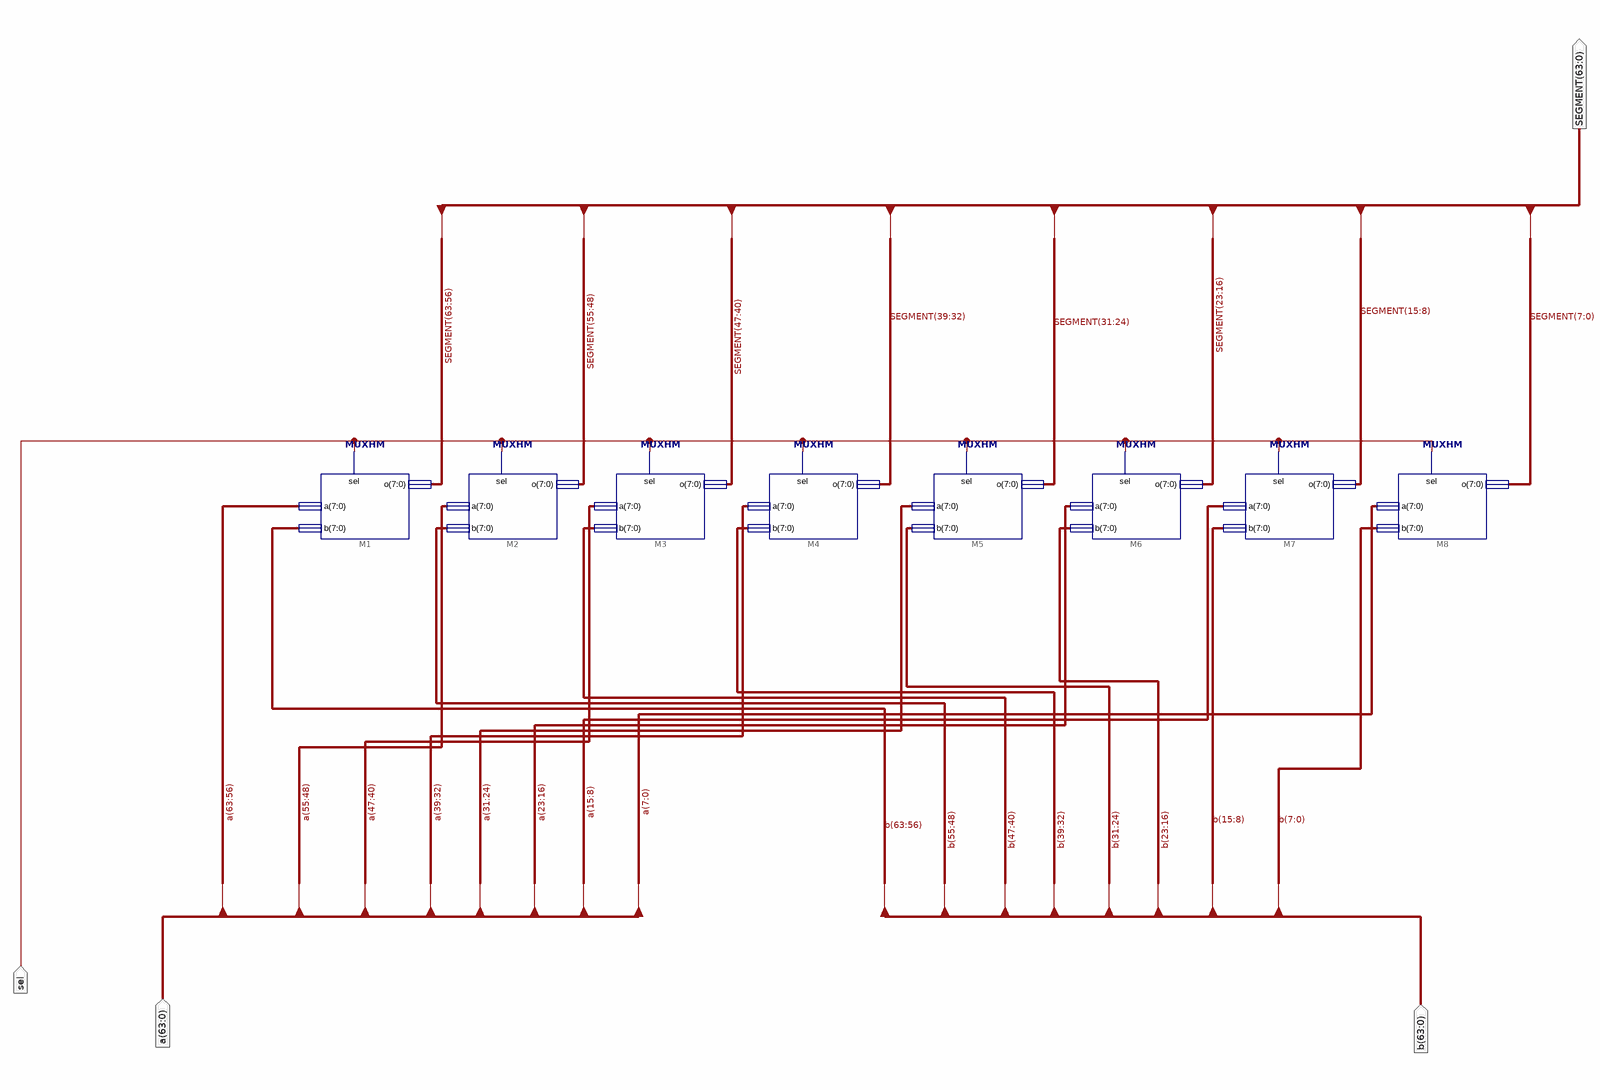
[diagram p0: schematic sheet 1]
// Xilinx ISE schematic MUXSH2M.sch (kintex7) as structural Verilog: 8 symbols, 4 ports
module MUXSH2M (
  input  [63:0] a,
  input  [63:0] b,
  input  sel,
  output [63:0] SEGMENT
);

  MUXHM M8 (.a(a[7:0]), .b(b[7:0]), .sel(sel), .o(SEGMENT[7:0]));
  MUXHM M7 (.a(a[15:8]), .b(b[15:8]), .sel(sel), .o(SEGMENT[15:8]));
  MUXHM M6 (.a(a[23:16]), .b(b[23:16]), .sel(sel), .o(SEGMENT[23:16]));
  MUXHM M5 (.a(a[31:24]), .b(b[31:24]), .sel(sel), .o(SEGMENT[31:24]));
  MUXHM M4 (.a(a[39:32]), .b(b[39:32]), .sel(sel), .o(SEGMENT[39:32]));
  MUXHM M3 (.a(a[47:40]), .b(b[47:40]), .sel(sel), .o(SEGMENT[47:40]));
  MUXHM M1 (.a(a[63:56]), .b(b[63:56]), .sel(sel), .o(SEGMENT[63:56]));
  MUXHM M2 (.a(a[55:48]), .b(b[55:48]), .sel(sel), .o(SEGMENT[55:48]));
endmodule
